# EAGLE design CanBus-Breadboard (EAGLE 7.4.0)
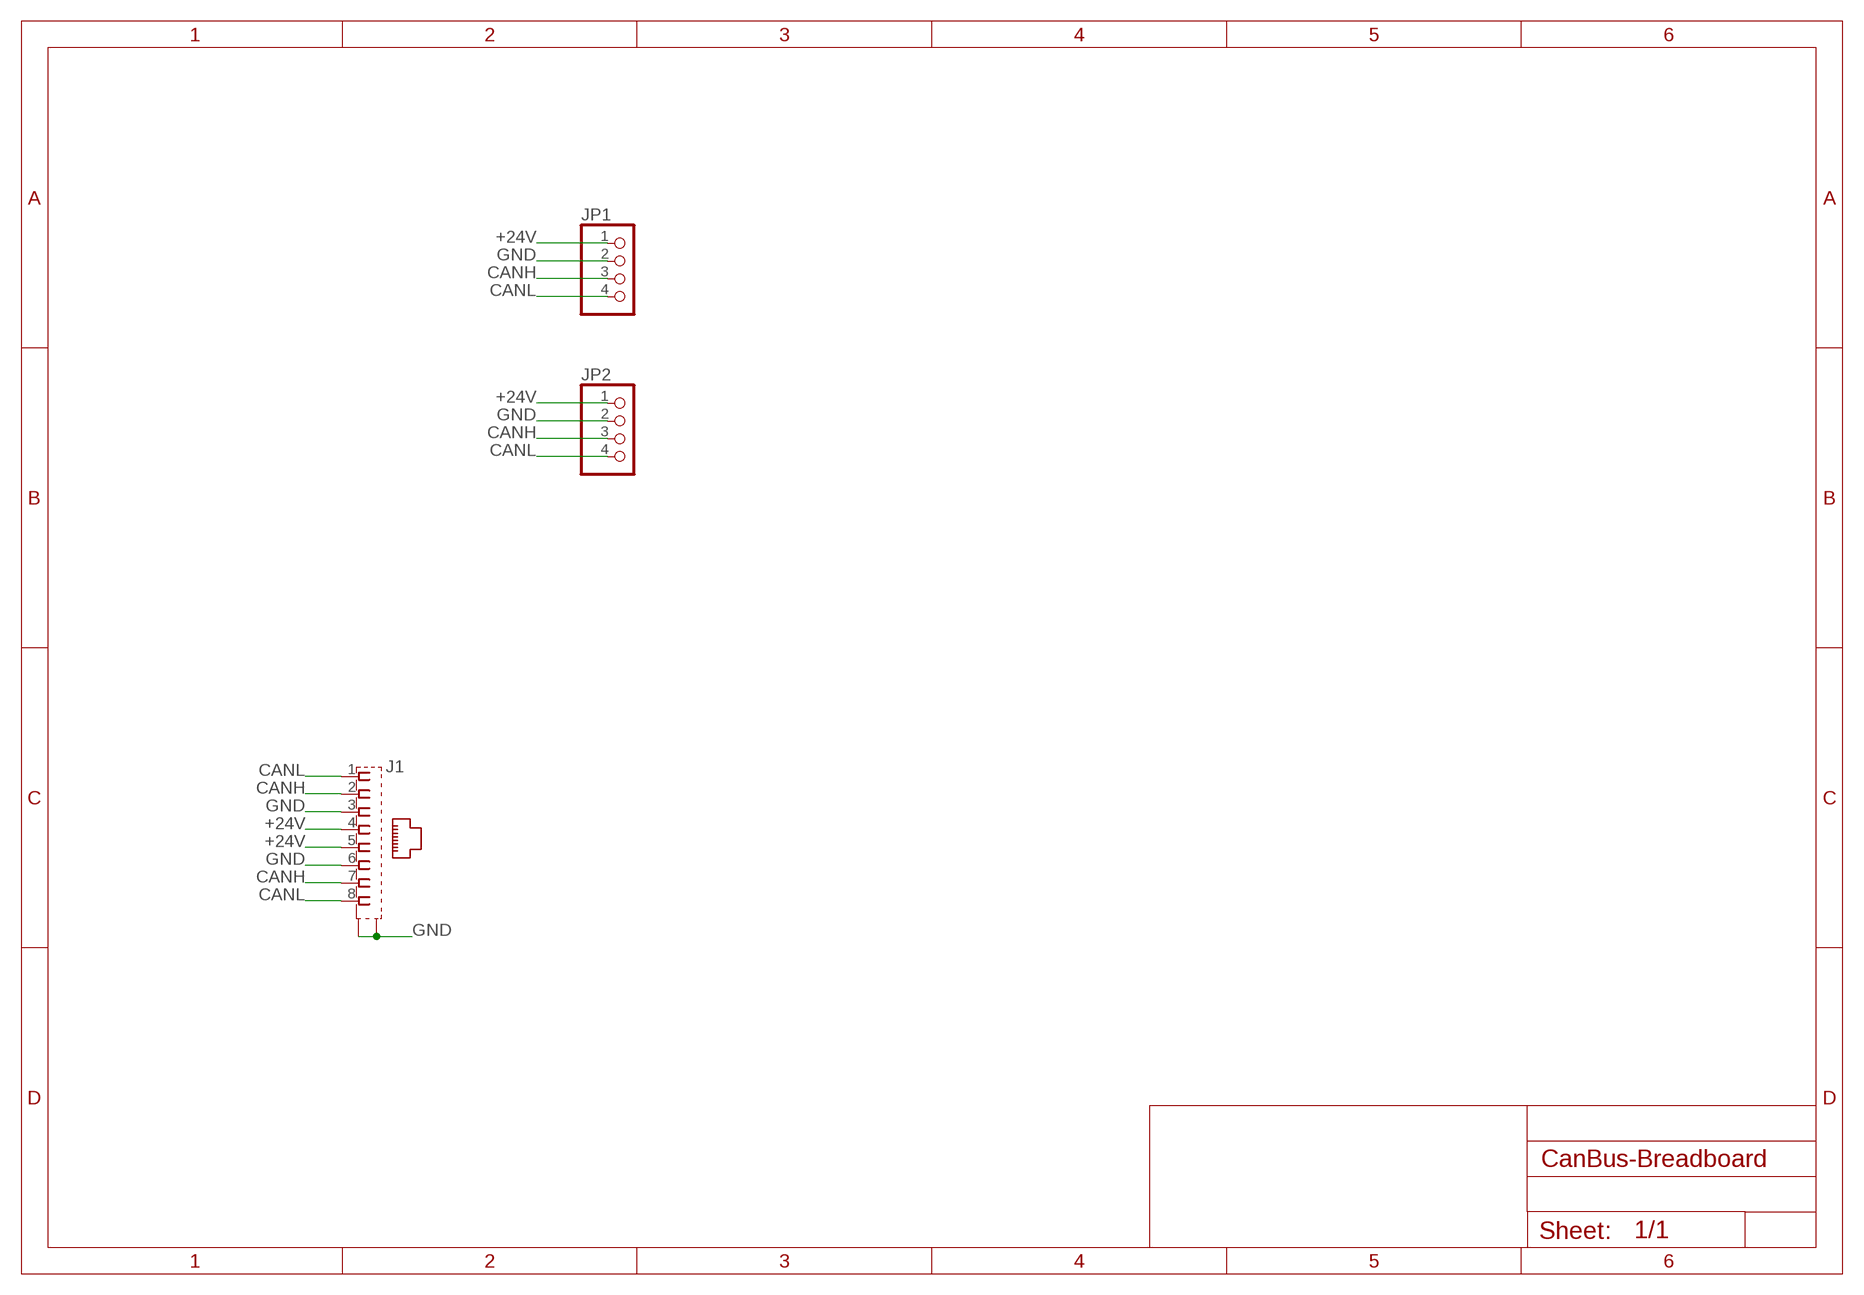
[diagram p0: schematic, sheet 1]

## Parts
J1  555141-1  [MEBP_8-8G]
JP1  PINHD-1X4  [1X04]
JP2  PINHD-1X4  [1X04]

## Nets
+24V: J1.4 J1.5 JP1.1 JP2.1
CANH: J1.2 J1.7 JP1.3 JP2.3
CANL: J1.1 J1.8 JP1.4 JP2.4
GND: J1.3 J1.6 J1.G1(S1) J1.G2(S2) JP1.2 JP2.2

## Library data of the parts
J1 = mebp_8-8g:555141-1: AMP connector Reichelt Bestell-Nr. MEBP 8-8G
JP1 JP2 = pinhead:PINHD-1X4: PIN HEADER

## Board
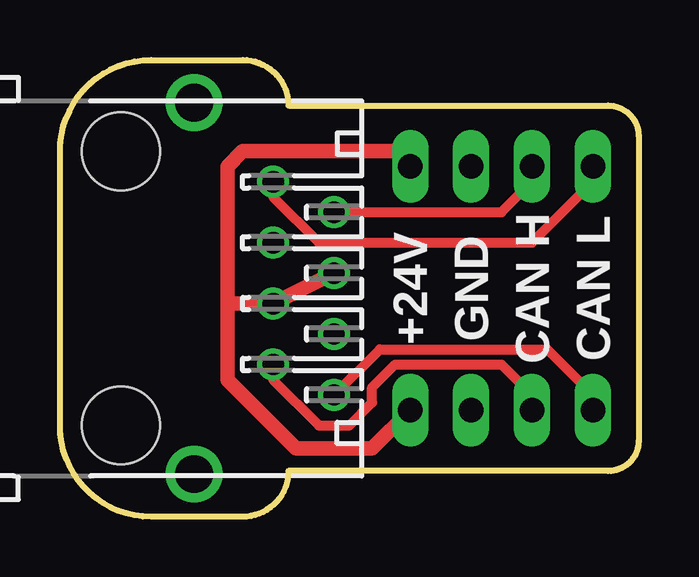
[diagram p1: board, top side]
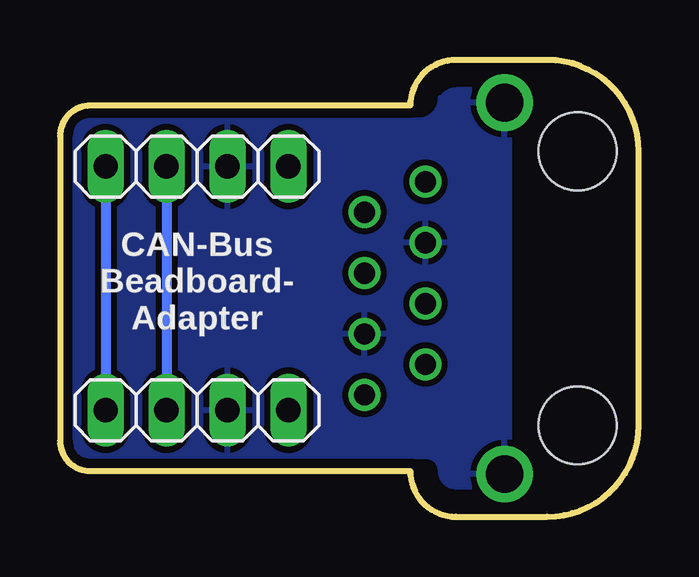
[diagram p2: board, bottom side, seen from below]

Size 24.13 x 19.05 mm. Coordinates in mm from the lower left corner, seen from the top.
Outline: 22.86,17.14 arc-90 24.13,15.88 24.13,3.17 arc-90 22.86,1.91 9.53,1.91 arc-90 7.62,0 3.81,0 arc-90 0,3.81 0,15.24 arc-90 3.81,19.05 7.62,19.05 arc-90 9.53,17.14 22.86,17.14
Copper layers (1*16): Top 0.035559375mm / dielectric 1.6mm / Bottom 0.035559375mm
Design rules "oshpark-2layer": minimum track width 6mil, minimum drill 10mil, track to track 6mil, track to pad 6mil, pad to pad 6mil, via to via 6mil, smd to smd 6mil, copper to edge 15mil, drill to drill 6mil, minimum pad ring 5mil, minimum via ring 5mil, stop-mask expansion 2.5mil, vias tented up to drill 0mil, thermal gap 10mil

### Footprints (pad centres in the part's own frame; a part is rotated, then mirrored left to right if it is on the bottom)
MEBP_8-8G = drill 0.889: 1 -4.445,6.35; 2 -3.175,8.89; 3 -1.905,6.35; 4 -0.635,8.89; 5 0.635,6.35; 6 1.905,8.89; 7 3.175,6.35; 8 4.445,8.89 | drill 1.575 pad 2.184: G1 -7.745,3.05; G2 7.745,3.05 | hole 3.251: -5.715,0; 5.715,0
1X04 = drill 1.016 long: 1 -3.81,0; 2 -1.27,0; 3 1.27,0; 4 3.81,0

### Placement (x,y rotation side)
J1  2.54,9.53 270 top
JP1  18.41,14.61 180 bottom
JP2  18.41,4.45 180 bottom

### Tracks (layer width: path | path; a pad name or v marks a point on that pad's centre or on a via)
+24V
  Top 0.61: JP1.1 13.97,15.24 7.62,15.24 6.99,14.61 6.99,8.89 | 6.99,8.89 6.99,5.71 9.84,2.86 13.02,2.86 JP2.1 | 6.99,8.89 J1.5 J1.4
CANH
  Top 0.406: J1.2 18.41,12.7 19.68,13.97 JP1.3 | J1.7 8.89,5.71 10.79,3.81 12.06,3.81 13.02,4.76 13.02,5.4 13.97,6.35 18.41,6.35 19.68,5.08 JP2.3
  Bottom 0.406: JP1.3 JP2.3
CANL
  Top 0.406: J1.1 8.89,13.34 10.79,11.43 19.68,11.43 22.23,13.97 JP1.4 | J1.8 13.34,6.99 20.32,6.99 22.23,5.08 JP2.4
  Bottom 0.406: JP1.4 JP2.4
GND
  pour Bottom (isolate 0.254): 22.86,16.51 arc-90 23.5,15.88 23.5,3.17 arc-90 22.86,2.54 8.89,2.54 arc90 8.26,1.91 arc-90 7.62,1.27 5.4,1.27 5.4,17.78 7.62,17.78 arc-90 8.26,17.14 8.26,17.46 arc90 9.21,16.51

### Text on the board
tNames: +24V | GND | CAN H | CAN L
bNames: CAN-Bus / Beadboard- / Adapter